# Altium schematic sheet CanController.SchDoc
size A4; CompanyName: HESSO; Address1: Route du Rawyl 47; Address2: 1950 Sion; Address3: Switzerland; DocumentNumber: 4; SheetNumber: 2; SheetTotal: 3; PageSetup: Record=PageOptions|CenterHorizontal=True|CenterVertical=True|PrintScale=1.00|XCorrection=1.00|YCorrection=1.00|PrintKind=1|BorderSize=5000000|LeftOffset=0|BottomOffset=0|Orientation=2|PaperLength=1000|PaperWidth=1000|Scale=100|PaperSource=15|PrintQuality=1200|MediaType=1|DitherType=10|PrintScaleMode=1|PaperKind=A4|PaperIndex=9; ProjectName: Project Name
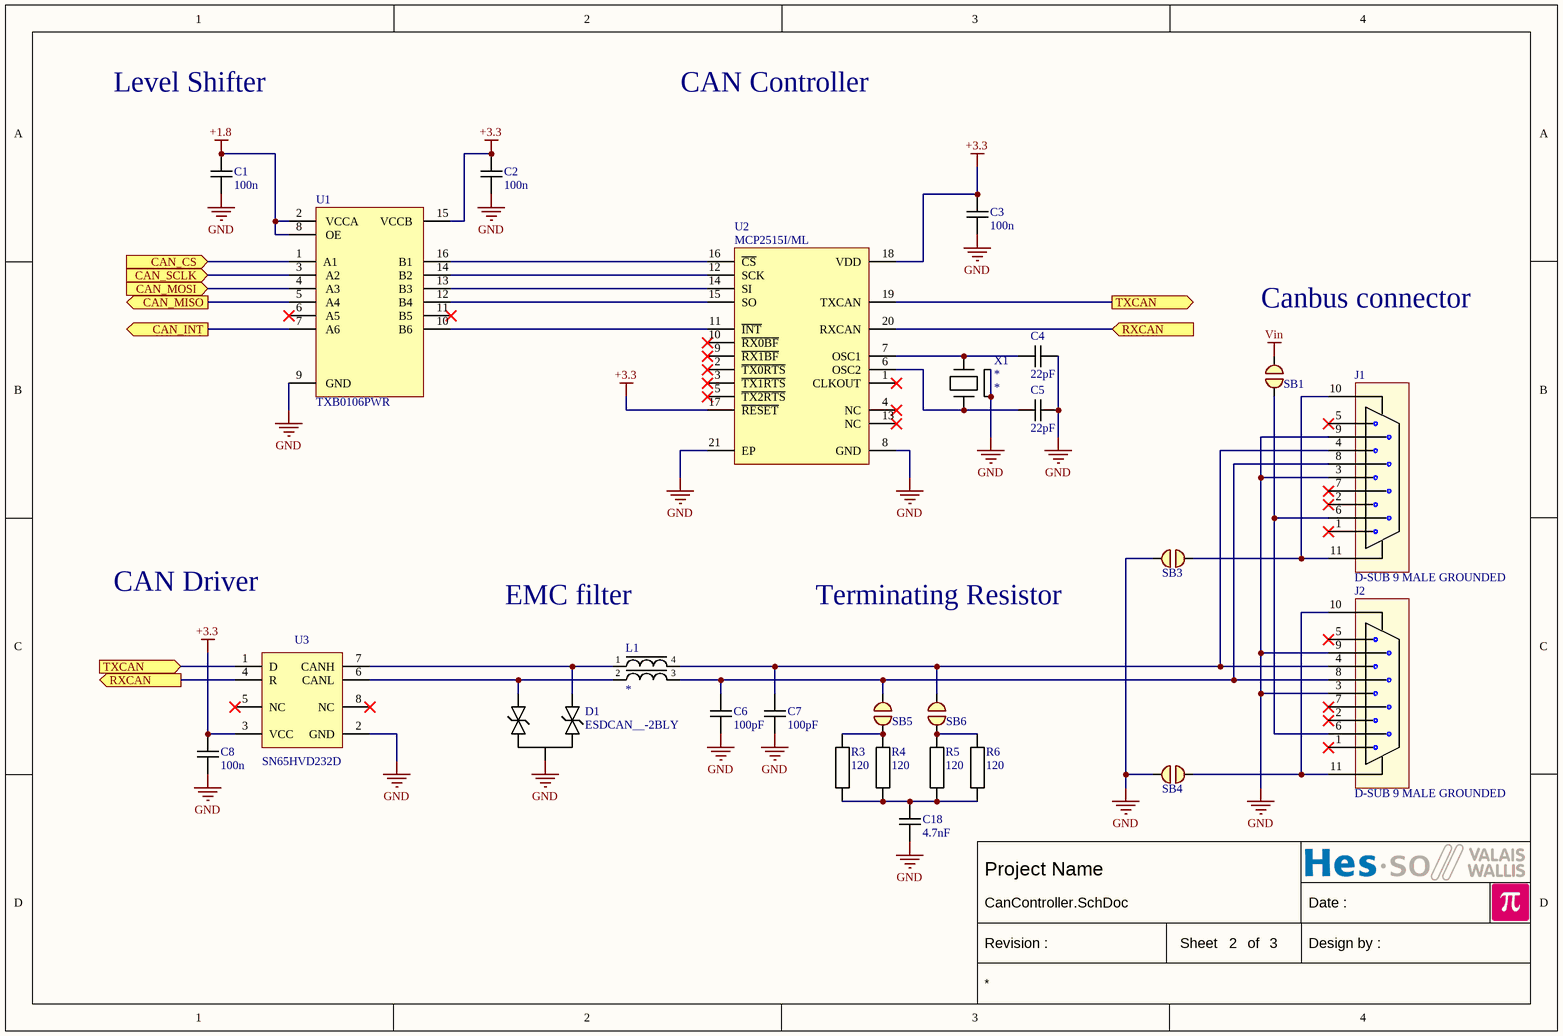
[diagram p0: CanController.SchDoc]

## Parts
C1  100n  [CAPACITOR 1608 REFLOW]
C2  100n  [CAPACITOR 1608 REFLOW]
C3  100n  [CAPACITOR 1608 REFLOW]
C4  22pF  [CAPACITOR 1608 REFLOW]
C5  22pF  [CAPACITOR 1608 REFLOW]
C6  100pF  [CAPACITOR 1608 REFLOW]
C7  100pF  [CAPACITOR 1608 REFLOW]
C8  100n  [CAPACITOR 1608 REFLOW]
C18  4.7nF  [CAPACITOR 1608 REFLOW]
D1  ESDCAN__-2BLY  [SOT23 P0.95 C1.6x3.0 H1.3]
J1  D-SUB 9 MALE GROUNDED  [D-SUB 9 MALE ANGLE]
J2  D-SUB 9 MALE GROUNDED  [D-SUB 9 MALE ANGLE]
L1  *  [L CM 2X B82793C EPCOS]
R3  120  [RESISTOR 1608 REFLOW]
R4  120  [RESISTOR 1608 REFLOW]
R5  120  [RESISTOR 1608 REFLOW]
R6  120  [RESISTOR 1608 REFLOW]
SB1  *  [Solder Bridge 1mm Unconnected]  (value not drawn)  (net tie, no BOM)
SB3  *  [Solder Bridge 1mm Unconnected]  (value not drawn)  (net tie, no BOM)
SB4  *  [Solder Bridge 1mm Unconnected]  (value not drawn)  (net tie, no BOM)
SB5  *  [Solder Bridge 1mm Unconnected]  (value not drawn)  (net tie, no BOM)
SB6  *  [Solder Bridge 1mm Unconnected]  (value not drawn)  (net tie, no BOM)
U1  TXB0106PWR  [TSSOP16 P0.65 C5.0x4.5 H1.1]
U2  MCP2515I/ML  [QFN20 P0.5 T2.05x2.05 C4.0x4.0 H0.85]
U3  SN65HVD232D  [SO8 P1.27 C4.0X5.0 H1.75]
X1  *  [CRYSTAL C3.2x2.5 Kyocera CX3225SB]

## Ports
CAN_CS (in), CAN_INT (out), CAN_MISO (out), CAN_MOSI (in), CAN_SCLK (in), RXCAN (in), RXCAN (out), TXCAN (in), TXCAN (out)

## Nets
+1.8: C1.2 U1.2(VCCA) U1.8(OE)
+3.3: C2.2 C3.2 C8.2 U1.15(VCCB) U2.17(~{RESET}) U2.18(VDD) U3.3(VCC)
GND: C1.1 C2.1 C3.1 C4.1 C5.1 C6.1 C7.1 C8.1 C18.1 D1.3(COM) J1.3 J1.9 J2.3 J2.9 SB3.1 SB4.1 U1.9(GND) U2.8(GND) U2.21(EP) U3.2(GND) X1.2 X1.4
Vin: SB1.1
CAN_CS: U1.1(A1) ; port CAN_CS
CAN_INT: U1.7(A6) ; port CAN_INT
CAN_MISO: U1.5(A4) ; port CAN_MISO
CAN_MOSI: U1.4(A3) ; port CAN_MOSI
CAN_SCLK: U1.3(A2) ; port CAN_SCLK
RXCAN: U2.20(RXCAN) U3.4(R) ; port RXCAN
TXCAN: U2.19(TXCAN) U3.1(D) ; port TXCAN
NetC4_2: C4.2 U2.7(OSC1) X1.3
NetC5_2: C5.2 U2.6(OSC2) X1.1
NetC6_2: C6.2 J1.8 J2.8 L1.3 SB5.2
NetC7_2: C7.2 J1.4 J2.4 L1.4 SB6.2
NetC18_2: C18.2 R3.1 R4.1 R5.1 R6.1
NetD1_1: D1.1(A1) L1.1 U3.7(CANH)
NetD1_2: D1.2(C2) L1.2 U3.6(CANL)
NetJ1_6: J1.6 J2.6 SB1.2
NetJ1_10: J1.10 J1.11 SB3.2
NetJ2_10: J2.10 J2.11 SB4.2
NetR3_2: R3.2 R4.2 SB5.1
NetR5_2: R5.2 R6.2 SB6.1
NetU1_10: U1.10(B6) U2.11(~{INT})
NetU1_12: U1.12(B4) U2.15(SO)
NetU1_13: U1.13(B3) U2.14(SI)
NetU1_14: U1.14(B2) U2.12(SCK)
NetU1_16: U1.16(B1) U2.16(~{CS})

Not connected (* = marked no-connect by the designer): J1 1* 2* 5* 7*; J2 1* 2* 5* 7*; U1 6(A5)* 11(B5)*; U2 1(CLKOUT)* 2(~{TX0RTS})* 3(~{TX1RTS})* 4(NC)* 5(~{TX2RTS})* 9(~{RX1BF})* 10(~{RX0BF})* 13(NC)*; U3 5(NC)* 8(NC)*

## Notes on the sheet
- Level Shifter
- CAN Controller
- Canbus connector
- CAN Driver
- EMC filter
- Terminating Resistor
- Date :
- Revision :
- Sheet
- of
- Design by :

## Library data of the parts
C1-C8 C18 = Capacitor: Value: *
D1 = Diode ESDCAN__-2BLY: Automotive dual-line TVS diode; Value: ESDCAN__-2BLY
J1 J2 = D-SUB 9 MALE GROUNDED: D-Subminiature 9 way Plug Right Angle; value: *
L1 = L CM 2X B82793C0 EPCOS: Inductor Common Mode Filter; Value: *
R3-R6 = Resistor: Value: *
SB1 SB3-SB6 = Solderbridge Unconnected: Value: *
U1 = TXB0106PWR: 6-Bit Bidirectional Level-Shifting and Voltage Translator / With Auto-Direction Sensing and ±15-kV ESD Protection; Value: TXB0106PWR
U2 = MCP2515I/ML: Stand-Alone CAN Controller with SPI Interface; Value: MCP2515I/ML
U3 = SN65HVD232D: CAN Bus Transceiver 3V3; Value: SN65HVD232D
X1 = Crystal C3.2x2.5 Kyocera CX3225SB: Value: *